# Altium schematic sheet Blackbox_BauhallenUhr_Schematic.SchDoc
size A4; DocumentNumber: 1; SheetNumber: 1; SheetTotal: 5
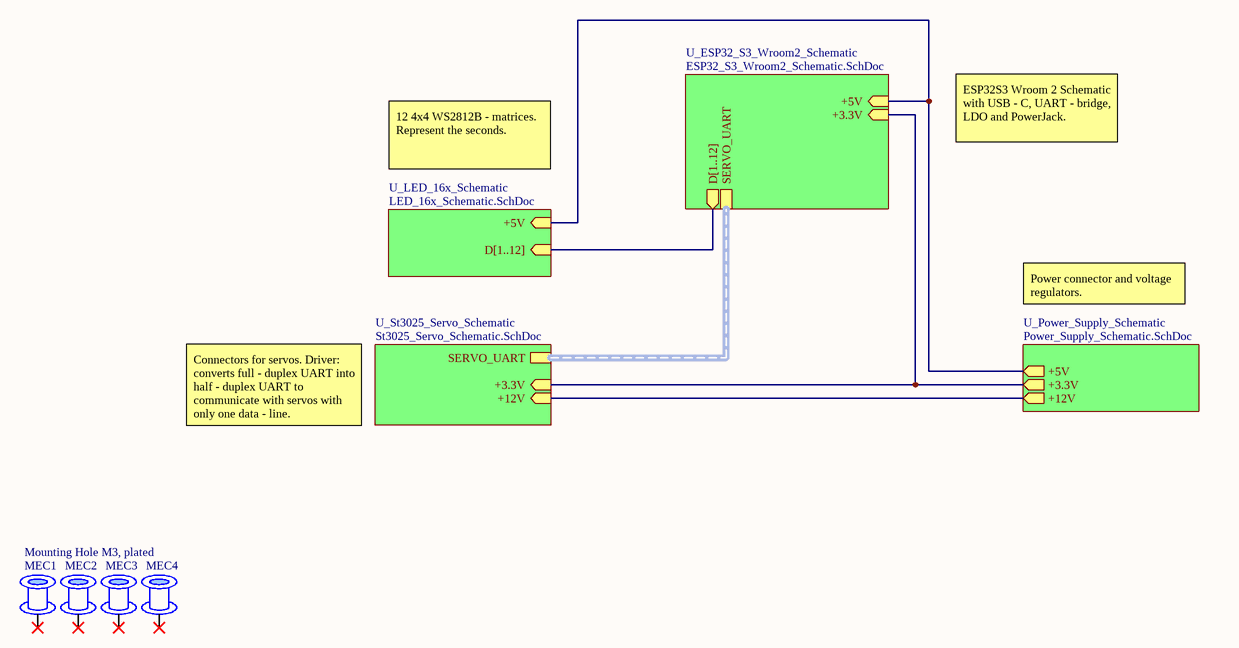
[diagram p0: Blackbox_BauhallenUhr_Schematic.SchDoc]

## Parts
MEC1  Mounting Hole M3, plated  [Mounting Hole M3, plated]
MEC2  Mounting Hole M3, plated  [Mounting Hole M3, plated]  (value not drawn)
MEC3  Mounting Hole M3, plated  [Mounting Hole M3, plated]  (value not drawn)
MEC4  Mounting Hole M3, plated  [Mounting Hole M3, plated]  (value not drawn)

## Sub-sheets
U_ESP32_S3_Wroom2_Schematic = ESP32_S3_Wroom2_Schematic.SchDoc: SERVO_UART (harness SERVO_UART), D[1..12] (out), +5V (in), +3.3V (in)
U_LED_16x_Schematic = LED_16x_Schematic.SchDoc: D[1..12] (in), +5V (in)
U_Power_Supply_Schematic = Power_Supply_Schematic.SchDoc: +12V (out), +3.3V (out), +5V (out)
U_St3025_Servo_Schematic = St3025_Servo_Schematic.SchDoc: SERVO_UART (harness SERVO_UART), +3.3V (in), +12V (in)

## Nets
(unnamed): sheet U_St3025_Servo_Schematic/+3.3V, sheet U_ESP32_S3_Wroom2_Schematic/+3.3V, sheet U_Power_Supply_Schematic/+3.3V
(unnamed): sheet U_St3025_Servo_Schematic/+12V, sheet U_Power_Supply_Schematic/+12V
(unnamed): sheet U_ESP32_S3_Wroom2_Schematic/+5V, sheet U_LED_16x_Schematic/+5V, sheet U_Power_Supply_Schematic/+5V

Not connected (* = marked no-connect by the designer): MEC1 1*; MEC2 1*; MEC3 1*; MEC4 1*

## Buses and harness runs
bus sheet U_ESP32_S3_Wroom2_Schematic/D[1..12] = sheet U_LED_16x_Schematic/D[1..12]
harness sheet U_ESP32_S3_Wroom2_Schematic/SERVO_UART = sheet U_St3025_Servo_Schematic/SERVO_UART

## Notes on the sheet
- 12 4x4 WS2812B - matrices. Represent the seconds.
- ESP32S3 Wroom 2 Schematic with USB - C, UART - bridge, LDO and PowerJack.
- Power connector and voltage regulators.
- Connectors for servos. Driver: converts full - duplex UART into half - duplex UART to communicate with servos with only one data - line.
- Date:
- Title of drawing:
- Time:
- Drawn by:
- Project:
- Revision:
- Institut:
- Departement:
- Page:
- from:
- File:

## Library data of the parts
MEC1-MEC4 = Mounting Hole M3, plated: Mounting Hole for M3 Screw, plated to connect signal